# Altium schematic sheet 0130_EC_MEC1521_2.SchDoc
size A3
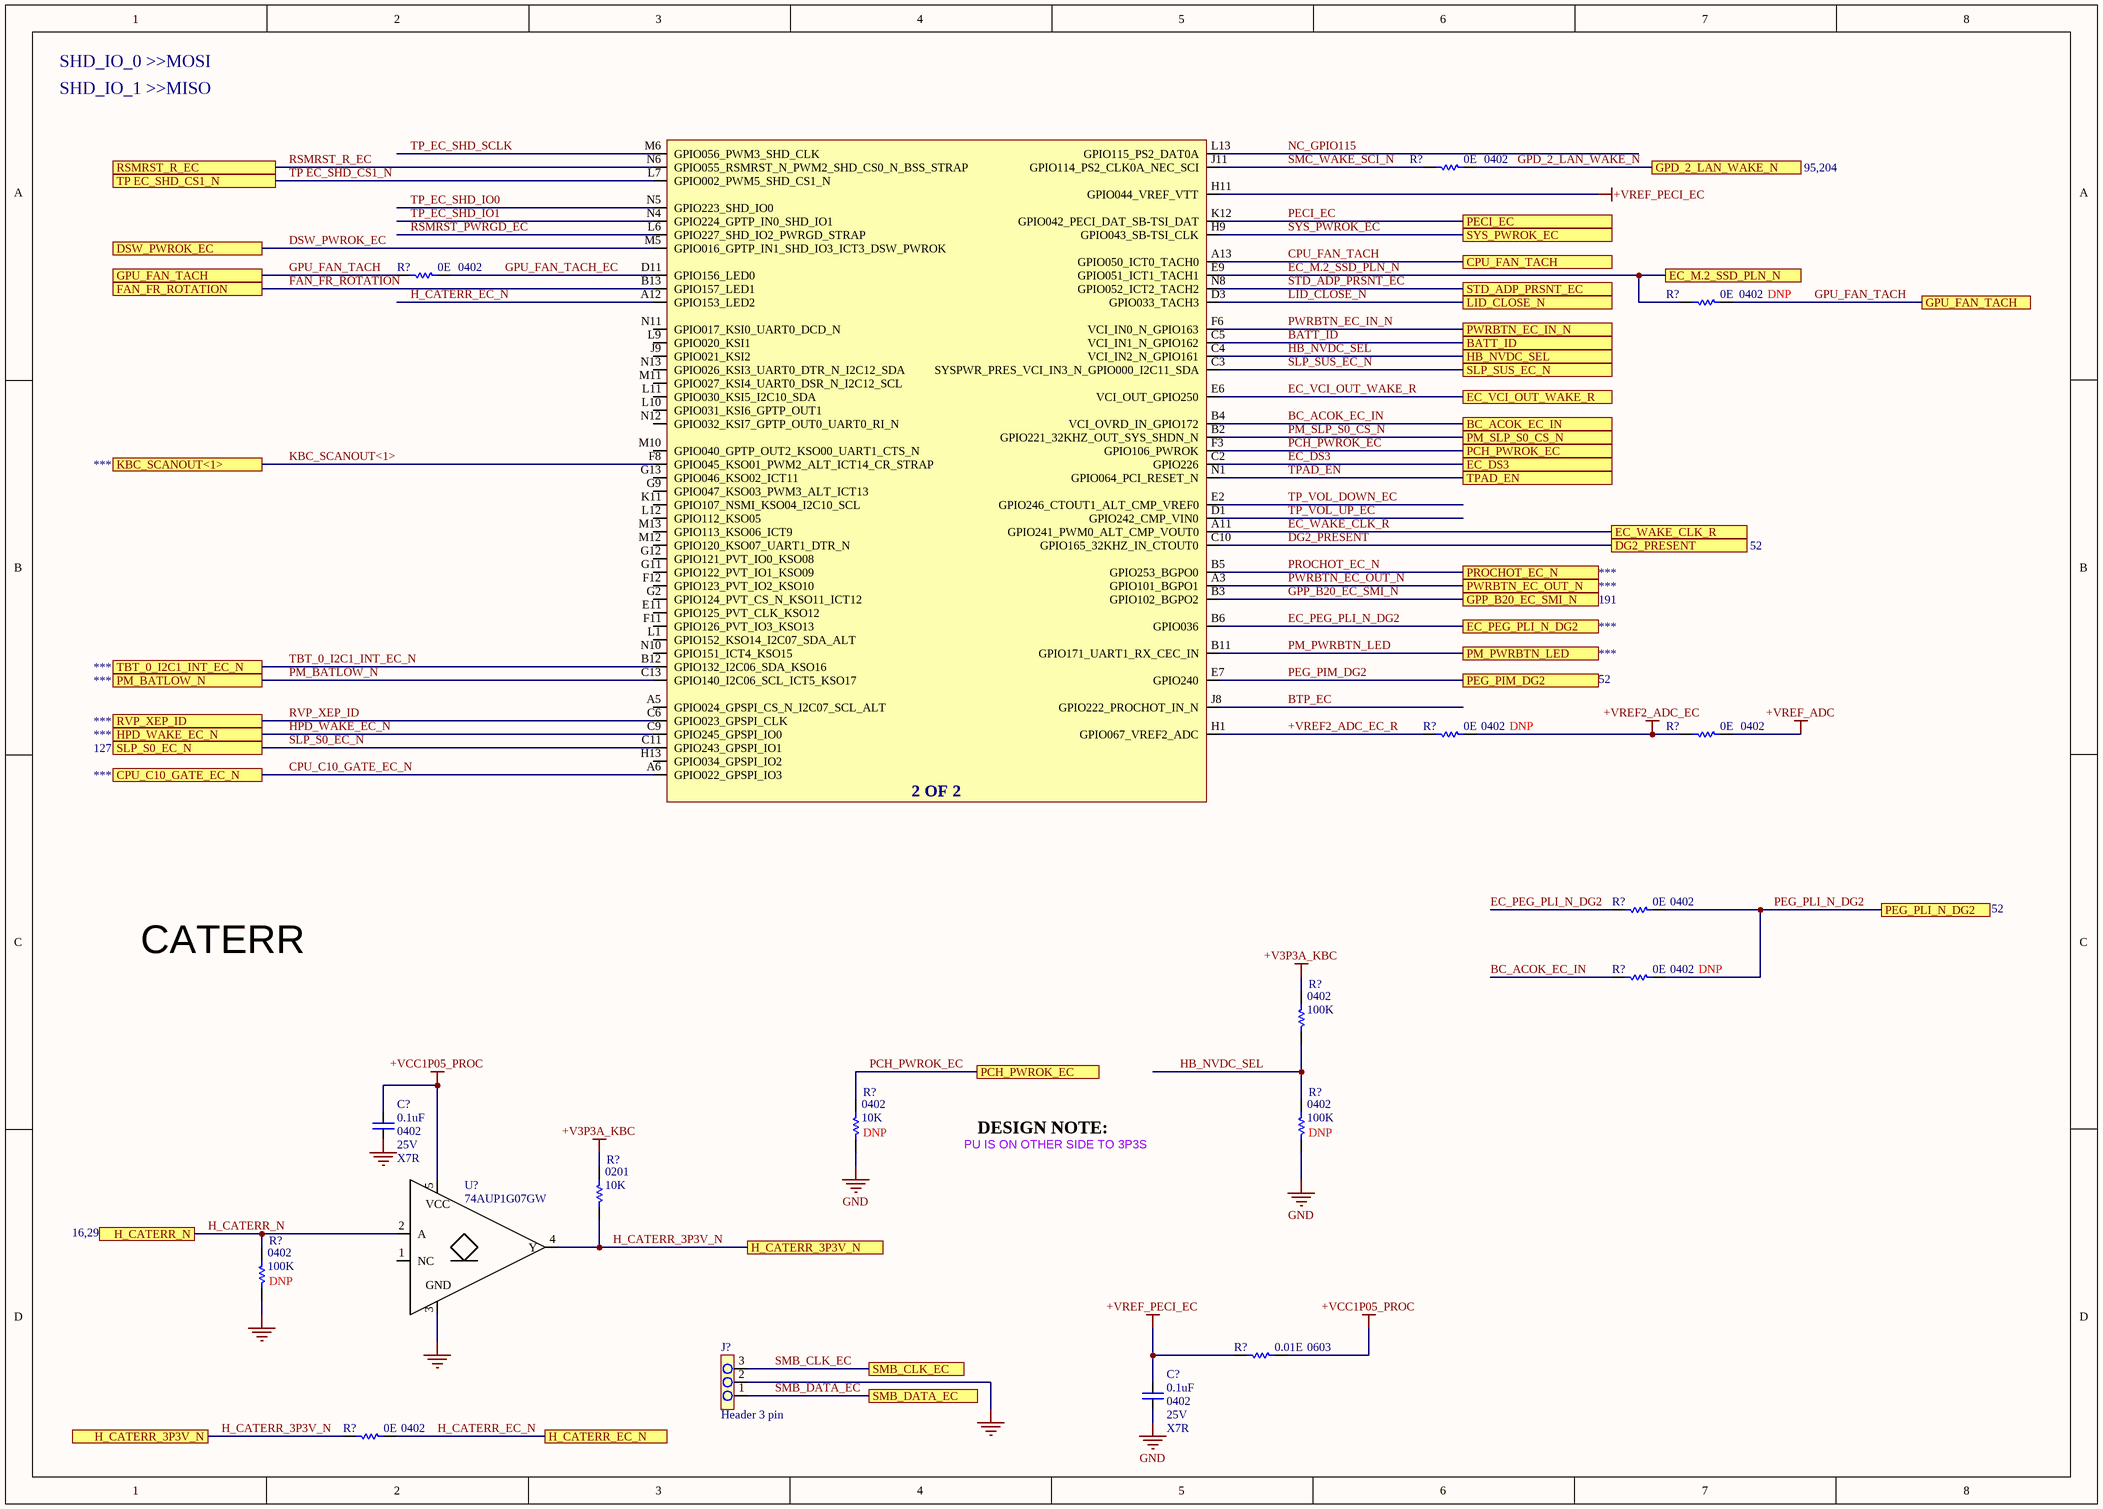
[diagram p0: 0130_EC_MEC1521_2.SchDoc]

## Parts
(Parts that share a designator on the sheet are numbered #1, #2 ... from top to bottom, then left to right.)
C?#1  value 0.1uF  Case/Package: 0402  Voltage: 25V  Dielectric: X7R  [CAPC0402]
C?#2  value 0.1uF  Case/Package: 0402  Voltage: 25V  Dielectric: X7R  [CAPC0402]
J?  Header 3 pin
R?#1  value 0E  Case/Package: 0402  [RESC0402]  (hidden comment: Res)
R?#2  value 0E  Case/Package: 0402  [RESC0402]  (hidden comment: Res)
R?#3  value 0E  Case/Package: 0402  [RESC0402]  (hidden comment: Res)
R?#4  value 0E  Case/Package: 0402  [RESC0402]  (hidden comment: Res)
R?#5  value 0E  Case/Package: 0402  [RESC0402]  (hidden comment: Res)
R?#6  value 0E  Case/Package: 0402  [RESC0402]  (hidden comment: Res)
R?#7  value 0E  Case/Package: 0402  [RESC0402]  (hidden comment: Res)
R?#8  value 100K  Case/Package: 0402  [RESC0402]  (hidden comment: Res)
R?#9  value 10K  Case/Package: 0402  [RESC0402]  (hidden comment: Res)
R?#10  value 100K  Case/Package: 0402  [RESC0402]  (hidden comment: Res)
R?#11  value 10K  Case/Package: 0201  [RESC0201]  (hidden comment: Res)
R?#12  value 100K  Case/Package: 0402  [RESC0402]  (hidden comment: Res)
R?#13  value 0.01E  Case/Package: 0603  [RESC0603]  (hidden comment: Res)
R?#14  value 0E  Case/Package: 0402  [RESC0402]  (hidden comment: Res)
U9F4  MEC152X_2  (value not drawn)  (part B of 2)
U?  74AUP1G07GW

## Ports
BATT_ID, BC_ACOK_EC_IN, CPU_C10_GATE_EC_N, CPU_FAN_TACH, DG2_PRESENT, DSW_PWROK_EC, EC_DS3, EC_M.2_SSD_PLN_N, EC_PEG_PLI_N_DG2, EC_VCI_OUT_WAKE_R, EC_WAKE_CLK_R, FAN_FR_ROTATION, GPD_2_LAN_WAKE_N, GPP_B20_EC_SMI_N, GPU_FAN_TACH, H_CATERR_3P3V_N, H_CATERR_EC_N, H_CATERR_N, HB_NVDC_SEL, HPD_WAKE_EC_N, KBC_SCANOUT<1>, LID_CLOSE_N, PCH_PWROK_EC, PECI_EC, PEG_PIM_DG2, PEG_PLI_N_DG2, PM_BATLOW_N, PM_PWRBTN_LED, PM_SLP_S0_CS_N, PROCHOT_EC_N, PWRBTN_EC_IN_N, PWRBTN_EC_OUT_N, RSMRST_R_EC, RVP_XEP_ID, SLP_S0_EC_N, SLP_SUS_EC_N, SMB_CLK_EC, SMB_DATA_EC, STD_ADP_PRSNT_EC, SYS_PWROK_EC, TBT_0_I2C1_INT_EC_N, TP EC_SHD_CS1_N, TPAD_EN

## Nets
+V3P3A_KBC: R?#8.2 R?#11.2
+VCC1P05_PROC: C?#1.1 R?#13.2 U?.5
+VREF2_ADC_EC: R?#4.2 R?#5.1
+VREF_ADC: R?#5.2
+VREF_PECI_EC: C?#2.1 R?#13.1 U9F4.H11(GPIO044_VREF_VTT)
GND: C?#1.2 C?#2.2 J?.2 R?#9.1 R?#10.1 R?#12.1 U?.3(GND)
+VREF2_ADC_EC_R: R?#4.1 U9F4.H1(GPIO067_VREF2_ADC)
BATT_ID: U9F4.C5(VCI_IN1_N_GPIO162) ; port BATT_ID
BC_ACOK_EC_IN: R?#7.1 U9F4.B4(VCI_OVRD_IN_GPIO172) ; port BC_ACOK_EC_IN
BTP_EC: U9F4.J8(GPIO222_PROCHOT_IN_N)
CPU_C10_GATE_EC_N: U9F4.A6(GPIO022_GPSPI_IO3) ; port CPU_C10_GATE_EC_N
CPU_FAN_TACH: U9F4.A13(GPIO050_ICT0_TACH0) ; port CPU_FAN_TACH
DG2_PRESENT: U9F4.C10(GPIO165_32KHZ_IN_CTOUT0) ; port DG2_PRESENT
DSW_PWROK_EC: U9F4.M5(GPIO016_GPTP_IN1_SHD_IO3_ICT3_DSW_PWROK) ; port DSW_PWROK_EC
EC_DS3: U9F4.C2(GPIO226) ; port EC_DS3
EC_M.2_SSD_PLN_N: R?#3.1 U9F4.E9(GPIO051_ICT1_TACH1) ; port EC_M.2_SSD_PLN_N
EC_PEG_PLI_N_DG2: R?#6.1 U9F4.B6(GPIO036) ; port EC_PEG_PLI_N_DG2
EC_VCI_OUT_WAKE_R: U9F4.E6(VCI_OUT_GPIO250) ; port EC_VCI_OUT_WAKE_R
EC_WAKE_CLK_R: U9F4.A11(GPIO241_PWM0_ALT_CMP_VOUT0) ; port EC_WAKE_CLK_R
FAN_FR_ROTATION: U9F4.B13(GPIO157_LED1) ; port FAN_FR_ROTATION
GPD_2_LAN_WAKE_N: R?#1.2 ; port GPD_2_LAN_WAKE_N
GPP_B20_EC_SMI_N: U9F4.B3(GPIO102_BGPO2) ; port GPP_B20_EC_SMI_N
GPU_FAN_TACH: R?#2.1 R?#3.2 ; port GPU_FAN_TACH
GPU_FAN_TACH_EC: R?#2.2 U9F4.D11(GPIO156_LED0)
H_CATERR_3P3V_N: R?#11.1 R?#14.1 U?.4(Y) ; port H_CATERR_3P3V_N
H_CATERR_EC_N: R?#14.2 U9F4.A12(GPIO153_LED2) ; port H_CATERR_EC_N
H_CATERR_N: R?#12.2 U?.2(A) ; port H_CATERR_N
HB_NVDC_SEL: R?#8.1 R?#10.2 U9F4.C4(VCI_IN2_N_GPIO161) ; port HB_NVDC_SEL
HPD_WAKE_EC_N: U9F4.C9(GPIO245_GPSPI_IO0) ; port HPD_WAKE_EC_N
KBC_SCANOUT<1>: U9F4.F8(GPIO045_KSO01_PWM2_ALT_ICT14_CR_STRAP) ; port KBC_SCANOUT<1>
LID_CLOSE_N: U9F4.D3(GPIO033_TACH3) ; port LID_CLOSE_N
NC_GPIO115: U9F4.L13(GPIO115_PS2_DAT0A)
PCH_PWROK_EC: R?#9.2 U9F4.F3(GPIO106_PWROK) ; port PCH_PWROK_EC
PECI_EC: U9F4.K12(GPIO042_PECI_DAT_SB-TSI_DAT) ; port PECI_EC
PEG_PIM_DG2: U9F4.E7(GPIO240) ; port PEG_PIM_DG2
PEG_PLI_N_DG2: R?#6.2 R?#7.2 ; port PEG_PLI_N_DG2
PM_BATLOW_N: U9F4.C13(GPIO140_I2C06_SCL_ICT5_KSO17) ; port PM_BATLOW_N
PM_PWRBTN_LED: U9F4.B11(GPIO171_UART1_RX_CEC_IN) ; port PM_PWRBTN_LED
PM_SLP_S0_CS_N: U9F4.B2(GPIO221_32KHZ_OUT_SYS_SHDN_N) ; port PM_SLP_S0_CS_N
PROCHOT_EC_N: U9F4.B5(GPIO253_BGPO0) ; port PROCHOT_EC_N
PWRBTN_EC_IN_N: U9F4.F6(VCI_IN0_N_GPIO163) ; port PWRBTN_EC_IN_N
PWRBTN_EC_OUT_N: U9F4.A3(GPIO101_BGPO1) ; port PWRBTN_EC_OUT_N
RSMRST_PWRGD_EC: U9F4.L6(GPIO227_SHD_IO2_PWRGD_STRAP)
RSMRST_R_EC: U9F4.N6(GPIO055_RSMRST_N_PWM2_SHD_CS0_N_BSS_STRAP) ; port RSMRST_R_EC
RVP_XEP_ID: U9F4.C6(GPIO023_GPSPI_CLK) ; port RVP_XEP_ID
SLP_S0_EC_N: U9F4.C11(GPIO243_GPSPI_IO1) ; port SLP_S0_EC_N
SLP_SUS_EC_N: U9F4.C3(SYSPWR_PRES_VCI_IN3_N_GPIO000_I2C11_SDA) ; port SLP_SUS_EC_N
SMB_CLK_EC: J?.3 ; port SMB_CLK_EC
SMB_DATA_EC: J?.1 ; port SMB_DATA_EC
SMC_WAKE_SCI_N: R?#1.1 U9F4.J11(GPIO114_PS2_CLK0A_NEC_SCI)
STD_ADP_PRSNT_EC: U9F4.N8(GPIO052_ICT2_TACH2) ; port STD_ADP_PRSNT_EC
SYS_PWROK_EC: U9F4.H9(GPIO043_SB-TSI_CLK) ; port SYS_PWROK_EC
TBT_0_I2C1_INT_EC_N: U9F4.B12(GPIO132_I2C06_SDA_KSO16) ; port TBT_0_I2C1_INT_EC_N
TP EC_SHD_CS1_N: U9F4.L7(GPIO002_PWM5_SHD_CS1_N) ; port TP EC_SHD_CS1_N
TP_EC_SHD_IO0: U9F4.N5(GPIO223_SHD_IO0)
TP_EC_SHD_IO1: U9F4.N4(GPIO224_GPTP_IN0_SHD_IO1)
TP_EC_SHD_SCLK: U9F4.M6(GPIO056_PWM3_SHD_CLK)
TP_VOL_DOWN_EC: U9F4.E2(GPIO246_CTOUT1_ALT_CMP_VREF0)
TP_VOL_UP_EC: U9F4.D1(GPIO242_CMP_VIN0)
TPAD_EN: U9F4.N1(GPIO064_PCI_RESET_N) ; port TPAD_EN

Not connected (* = marked no-connect by the designer): U9F4 A5(GPIO024_GPSPI_CS_N_I2C07_SCL_ALT) E11(GPIO125_PVT_CLK_KSO12) F11(GPIO126_PVT_IO3_KSO13) F12(GPIO123_PVT_IO2_KSO10) G2(GPIO124_PVT_CS_N_KSO11_ICT12) G9(GPIO047_KSO03_PWM3_ALT_ICT13) G11(GPIO122_PVT_IO1_KSO09) G12(GPIO121_PVT_IO0_KSO08) G13(GPIO046_KSO02_ICT11) H13(GPIO034_GPSPI_IO2) J9(GPIO021_KSI2) K11(GPIO107_NSMI_KSO04_I2C10_SCL) L1(GPIO152_KSO14_I2C07_SDA_ALT) L9(GPIO020_KSI1) L10(GPIO031_KSI6_GPTP_OUT1) L11(GPIO030_KSI5_I2C10_SDA) L12(GPIO112_KSO05) M10(GPIO040_GPTP_OUT2_KSO00_UART1_CTS_N) M11(GPIO027_KSI4_UART0_DSR_N_I2C12_SCL) M12(GPIO120_KSO07_UART1_DTR_N) M13(GPIO113_KSO06_ICT9) N10(GPIO151_ICT4_KSO15) N11(GPIO017_KSI0_UART0_DCD_N) N12(GPIO032_KSI7_GPTP_OUT0_UART0_RI_N) N13(GPIO026_KSI3_UART0_DTR_N_I2C12_SDA); U? 1(NC)

## Notes on the sheet
- SHD_IO_0 >>MOSI
- SHD_IO_1 >>MISO
- CATERR
- PU IS ON OTHER SIDE TO 3P3S
- DESIGN NOTE:
- (in symbol 74AUP1G07GW) VCC
- (in symbol MEC152X_2, part B) 2 OF 2

## Library data of the parts
C?#1 C?#2 = Cap: CAP CER 0.1uF 25V X7R 0402
R?#1-R?#7 R?#14 = Res: Thick Film Resistor -  0ohm, 1%, 0402
  R?#3 R?#4 R?#7: DNP: DNP
R?#8 R?#10 R?#12 = Res: Thick Film Resistor - 100Kohm, 1%, 0402
  R?#10 R?#12: DNP: DNP
R?#9 = Res: Thick Film Resistor - 10Kohm, 1%, 0402; DNP: DNP
R?#11 = Res: Thick Film Resistor - 10Kohm, 1%, 0201
R?#13 = Res: Thick Film Resistor -  0.01ohm, 1%, 0603
U9F4 = MEC152X_2: Case/Package: *; Manufacturer Part Number: *